# Altium schematic sheet High Voltage Section.SchDoc: Title
size B; Organization: Midnight Sun Solar Rayce Car Team; Address1: University of Waterloo; Address2: 200 University Ave W; Address3: Waterloo, ON, Canada; Address4: N2L 3E9; Website: www.uwmidsun.com; ProjectName: ProjectName
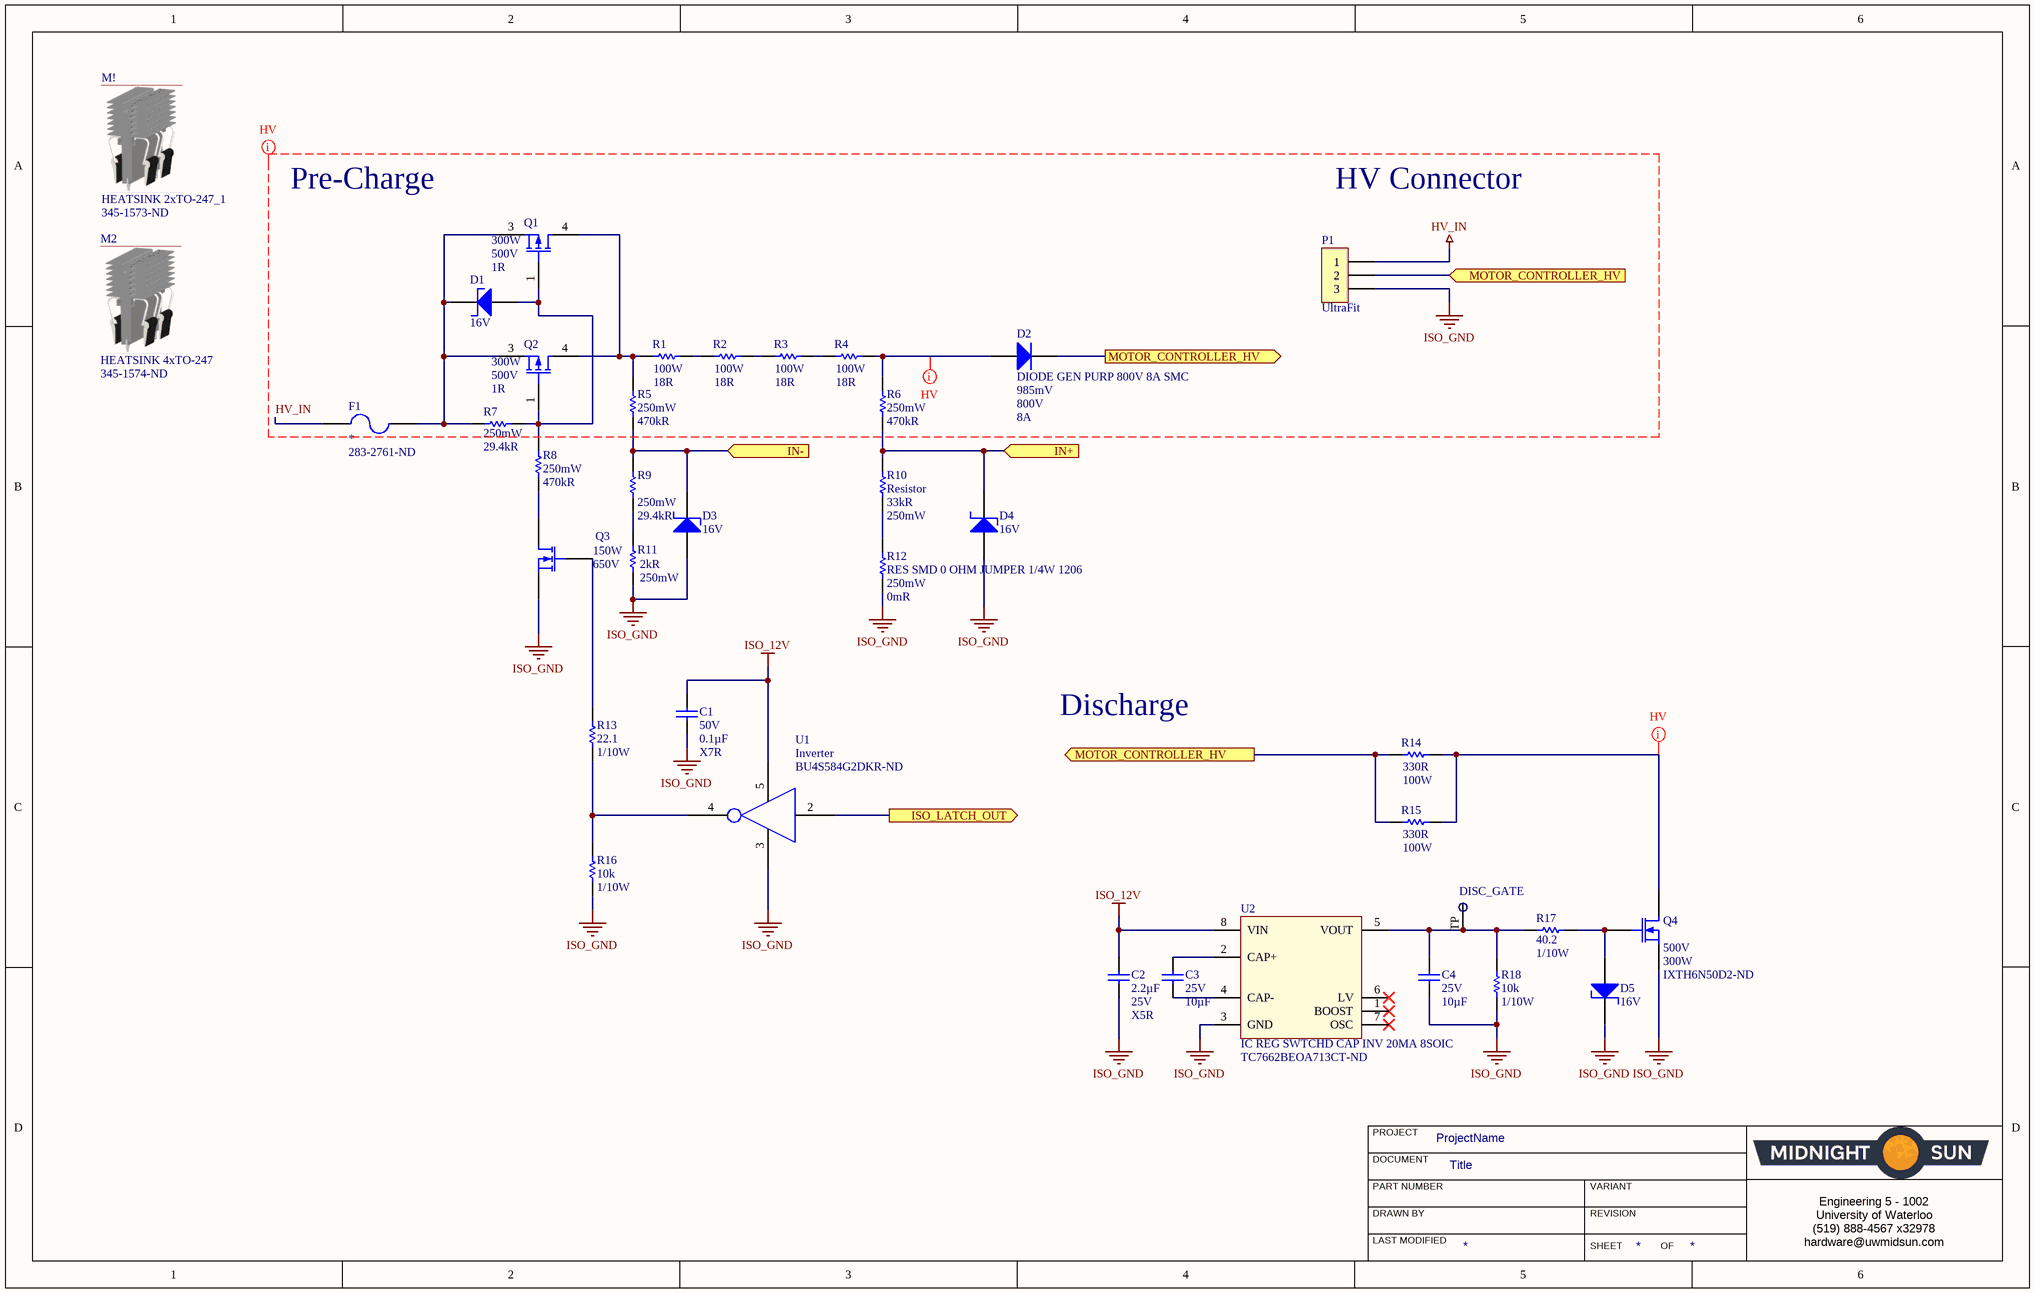
[diagram p0: High Voltage Section.SchDoc]

## Parts
C1  Voltage: 50V  Capacitance: 0.1µF  Temperature Coefficient: X7R  [CAP, 0603]  (hidden comment: CAP CER 0.1UF 50V 10% X7R 0603)
C2  Capacitance: 2.2µF  Voltage: 25V  Temperature Coefficient: X5R  [CAP, 0603]  (hidden comment: CAP CER 2.2UF 25V 10% X5R 0603)
C3  Voltage - Rated: 25V  Capacitance: 10µF  [CAP, 0805]  (hidden comment: CAP CER 10uF 25V 10% X5R 0805)
C4  Voltage - Rated: 25V  Capacitance: 10µF  [CAP, 0805]  (hidden comment: CAP CER 10uF 25V 10% X5R 0805)
D1  Voltage - Zener (Nom): 16V  [DO-214AA Diode]  (hidden comment: DIODE ZENER 16V 5W DO-214AA (SMB))
D2  DIODE GEN PURP 800V 8A SMC  Forward Voltage: 985mV  Max Reverse Voltage (DC): 800V  Forward Current: 8A  [DIODE, SMC]
D3  Voltage - Zener (Nom): 16V  [DO-214AA Diode]  (hidden comment: DIODE ZENER 16V 5W DO-214AA (SMB))
D4  Voltage - Zener (Nom): 16V  [DO-214AA Diode]  (hidden comment: DIODE ZENER 16V 5W DO-214AA (SMB))
D5  Voltage - Zener (Nom): 16V  [DO-214AA Diode]  (hidden comment: DIODE ZENER 16V 5W DO-214AA (SMB))
DISC_GATE  Test Point  [Test Point]  (value not drawn)  (no BOM)
F1  *  [FUSE 5A 400VDC RADIAL]
M2  HEATSINK 4xTO-247  Supplier Part Number 1: 345-1574-ND  [HEATSINK 4x TO-247]
M!  HEATSINK 2xTO-247_1  Supplier Part Number 1: 345-1573-ND  [HEATSINK 2x TO-247]
P1  Series: UltraFit  (hidden comment: CONN 3POS ULTRA-FIT 0.138")
Q1  Max Power Dissipation: 300W  Rds On Max: 1R  Drain to Source Voltage (Vdss): 500V  [P-CH MOSFET 500V 10A 300W TO-263]  (hidden comment: IXTA10P50P)
Q2  Max Power Dissipation: 300W  Rds On Max: 1R  Drain to Source Voltage (Vdss): 500V  [P-CH MOSFET 500V 10A 300W TO-263]  (hidden comment: IXTA10P50P)
Q3  Max Power Dissipation: 150W  Drain to Source Voltage (Vdss): 650V  [P-CH MOSFET 500V 10A 300W TO-263]  (hidden comment: MOSFET N-CH 650V 8A X2 TO-263)
Q4  Drain to Source Voltage (Vdss): 500V  Max Power Dissipation: 300W  Supplier Part Number 1: IXTH6N50D2-ND  [N-CH Depletion Mode TO-247-3]  (hidden comment: MOSFET DEPLETION N-CH 500V 6A TO247)
R1  Power Rating: 100W  Resistance: 18R  [RES TO-247-2]  (hidden comment: RES 18 OHM 100W 5% TO-247)
R2  Power Rating: 100W  Resistance: 18R  [RES TO-247-2]  (hidden comment: RES 18 OHM 100W 5% TO-247)
R3  Power Rating: 100W  Resistance: 18R  [RES TO-247-2]  (hidden comment: RES 18 OHM 100W 5% TO-247)
R4  Power Rating: 100W  Resistance: 18R  [RES TO-247-2]  (hidden comment: RES 18 OHM 100W 5% TO-247)
R5  Max Power Dissipation: 250mW  Resistance: 470kR  [RES 1206]  (hidden comment: RESISTOR)
R6  Max Power Dissipation: 250mW  Resistance: 470kR  [RES 1206]  (hidden comment: RESISTOR)
R7  Max Power Dissipation: 250mW  Resistance: 29.4kR  [RES 1206]  (hidden comment: Resistor)
R8  Max Power Dissipation: 250mW  Resistance: 470kR  [RES 1206]  (hidden comment: RESISTOR)
R9  Max Power Dissipation: 250mW  Resistance: 29.4kR  [RES 1206]  (hidden comment: Resistor)
R10  Resistor  Resistance: 33kR  Max Power Dissipation: 250mW  [RES 1206]
R11  Max Power Dissipation: 250mW  Resistance: 2kR  [RES 1206]  (hidden comment: RES SMD 2K OHM 0.1% 1/4W 1206)
R12  RES SMD 0 OHM JUMPER 1/4W 1206  Power Rating: 250mW  Resistance: 0mR  [RES 1206]
R13  Resistance: 22.1  Power: 1/10W  [RES, 0603]  (hidden comment: RES 22.1 OHM 1% 1/10W 0603)
R14  Max Power Dissipation: 100W  Resistance: 330R  [RES TO-247-2]  (hidden comment: RES 330 OHM 100W 5% TO-247)
R15  Max Power Dissipation: 100W  Resistance: 330R  [RES TO-247-2]  (hidden comment: RES 330 OHM 100W 5% TO-247)
R16  Resistance: 10k  Power: 1/10W  [RES, 0603]  (hidden comment: RES 10K OHM 1% 1/10W 0603)
R17  Resistance: 40.2  Power: 1/10W  [RES, 0603]  (hidden comment: RES 40.2 OHM 0.5% 1/10W 0603)
R18  Resistance: 10k  Power: 1/10W  [RES, 0603]  (hidden comment: RES 10K OHM 1% 1/10W 0603)
U1  Inverter  Supplier Part Number 1: BU4S584G2DKR-ND  [SSOP5 - Inverter]
U2  IC REG SWTCHD CAP INV 20MA 8SOIC  Supplier Part Number 1: TC7662BEOA713CT-ND  [SOIC8]

## Ports
IN+ (in), IN- (in), ISO_LATCH_OUT (out), MOTOR_CONTROLLER_HV (in), MOTOR_CONTROLLER_HV (out)

## Nets
HV_IN: F1.1 P1.1
ISO_12V: C1.1 C2.2 U1.5(IN+) U2.8(VIN)
ISO_GND: C1.2 C2.1 C4.2 D3.1(A) D4.1(A) D5.2(K) P1.3 Q3.3(S) Q4.3(S) R11.2 R12.2 R16.2 R18.2 U1.3(IN-) U2.3(GND)
IN+: D4.2(K) R6.2 R10.1 ; port IN+
IN-: D3.2(K) R5.2 R9.1 ; port IN-
ISO_LATCH_OUT: U1.2(INPUT) ; port ISO_LATCH_OUT
MOTOR_CONTROLLER_HV: D2.1(K) P1.2 R14.1 R15.1 ; port MOTOR_CONTROLLER_HV
NetC3_1: C3.1 U2.2(CAP+)
NetC3_2: C3.2 U2.4(CAP-)
NetC4_1: C4.1 DISC_GATE.TP R17.1 R18.1 U2.5(VOUT)
NetD1_1: D1.1(A) Q1.1(G) Q2.1(G) R7.2 R8.1
NetD1_2: D1.2(K) F1.2 Q1.3(S) Q2.3(S) R7.1
NetD2_2: D2.2(A) R4.2 R6.1
NetD5_1: D5.1(A) Q4.1(G) R17.2
NetQ1_4: Q1.4(D) Q2.4(D) R1.1 R5.1
NetQ3_1: Q3.1(G) R13.1
NetQ3_4: Q3.4(D) R8.2
NetQ4_2: Q4.2(D) R14.2 R15.2
NetR1_2: R1.2 R2.1
NetR2_2: R2.2 R3.1
NetR3_2: R3.2 R4.1
NetR9_2: R9.2 R11.1
NetR10_2: R10.2 R12.1
NetR13_2: R13.2 R16.1 U1.4(OUTPUT)

Not connected (* = marked no-connect by the designer): U2 1(BOOST)* 6(LV)* 7(OSC)*

## Layout directives
rule Clearance Constraint [Clearance = 1.25mm]; net class HV: HV_IN, ISO_GND, NetD2_2
rule Clearance Constraint [Generic clearance = 0.254mm, and 9 value(s) for objects]; net class HV: NetQ4_2

## Notes on the sheet
- Pre-Charge
- HV Connector
- Discharge
- PROJECT
- DOCUMENT
- DRAWN BY
- LAST MODIFIED
- PART NUMBER
- REVISION
- SHEET
- VARIANT
- OF
- Engineering 5 - 1002
  University of Waterloo
  (519) 888-4567 x32978
  hardware@uwmidsun.com

## Library data of the parts
C1 = CAP CER 0.1UF 50V 10% X7R 0603: 0.10µF ±10% 50V Ceramic Capacitor X7R 0603 (1608 Metric); Manufacturer 1: AVX Corporation; Manufacturer Part Number 1: 06035C104KAT2A; Supplier 1: Digi-Key; Supplier Part Number 1: 478-5052-1-ND; Packaging: Cut Tape (CT); Part Status: Active; Operating Temperature: -55°C ~ 125°C; Ratings: -; Mounting Type: Surface Mount, MLCC; Package / Case: 0603 (1608 Metric); Size / Dimension: 0.063" L x 0.032" W (1.60mm x 0.81mm); Height - Seated (Max): -; Thickness (Max): 0.035" (0.90mm); Lead Spacing: -; Lead Style: -; ComponentLink1URL: http://datasheets.avx.com/X7RDielectric.pdf; ComponentLink1Description: http://datasheets.avx.com/X7RDielectric.pdf; Tolerance: ±10%
C2 = CAP CER 2.2UF 25V 10% X5R 0603: 2.2µF ±10% 25V Ceramic Capacitor X5R 0603 (1608 Metric); Manufacturer 1: Murata Electronics North America; Manufacturer Part Number 1: GRM188R61E225KA12D; Supplier 1: Digi-Key; Supplier Part Number 1: 490-10731-1-ND; Packaging: Cut Tape (CT); Part Status: Active; Operating Temperature: -55°C ~ 85°C; Ratings: -; Mounting Type: Surface Mount, MLCC; Package / Case: 0603 (1608 Metric); Size / Dimension: 0.063" L x 0.031" W (1.60mm x 0.80mm); Height - Seated (Max): -; Thickness (Max): 0.035" (0.90mm); Lead Spacing: -; Lead Style: -; ComponentLink1URL: http://www.murata.com/~/media/webrenewal/support/library/catalog/products/capacitor/mlcc/c02e.ashx; ComponentLink1Description: http://www.murata.com/~/media/webrenewal/support/library/catalog/products/capacitor/mlcc/c02e.ashx; Tolerance: ±10%
C3 C4 = CAP CER 10uF 25V 10% X5R 0805: 10µF ±10% 25V Ceramic Capacitor X5R 0805 (2012 Metric); Manufacturer: Murata Electronics North America; Manufacturer Part Number: GRM21BR61E106KA73L; Supplier 1: Digi-Key; RoHS: RoHS Compliant; Category: Capacitors; Stock 1: 1695157; Packaging: Cut Tape (CT); Part Status: Active; Tolerance: ±10%; Temperature Coefficient: X5R; Operating Temperature: -55°C ~ 85°C; Features: -; Ratings: -; Applications: General Purpose; Mounting Type: Surface Mount, MLCC; Package / Case: 0805 (2012 Metric); Size / Dimension: 0.079" L x 0.049" W (2.00mm x 1.25mm); Height - Seated (Max): -; Thickness (Max): 0.053" (1.35mm); Lead Spacing: -; Lead Style: -; ComponentLink1URL: http://search.murata.co.jp/Ceramy/image/img/A01X/G101/ENG/GRM21BR61E106KA73-01.pdf; ComponentLink1Description: http://search.murata.co.jp/Ceramy/image/img/A01X/G101/ENG/GRM21BR61E106KA73-01.pdf; Supplier Part Number 1: 490-5523-1-ND; Pricing 1: 1=0.3, 10=0.214, 100=0.1008, 500=0.07068, 1000=0.05851 (CAD)
D1 D3-D5 = DIODE ZENER 16V 5W DO-214AA (SMB): Zener Diode 16V 5W ±5% Surface Mount DO-214AA (SMB); Manufacture: Micro Commercial Co; Manufacture Part Number: SMBJ5353B-TP; Impedence (Max): 2.5 Ohm; Voltage - Forward: 1.2V @ 1A; Power (Max): 5W; Supplier 1: Digi-Key; Supplier Part Number 1: SMBJ5353B-TPMSCT-ND
D2 = DIODE GEN PURP 800V 8A SMC: Manufacturer: Diodes; Manufacturer Part Number: S8KC-13; Peak Reverse Current: 10uA; Max Surge Current: 200A; Element Configuration: Single; Supplier 1: Digi-Key; Stock 1: 38298; Pricing 1: 1=0.68, 10=0.598, 100=0.4586, 500=0.36256, 1000=0.29005 (USD); Mount: Surface Mount; Case/Package: SMC; Number of Pins: 2; Weight: 0.007408oz; Contact Plating: Tin,Matte; Min Operating Temperature: -65°C; Max Operating Temperature: 150°C; Packaging: Tape and Reel; Package Quantity: 3000; Reverse Voltage (DC): 800V; Average Rectified Current: 8A; Max Repetitive Reverse Voltage (Vrrm): 800V; Peak Non-Repetitive Surge Current: 200A; Max Forward Surge Current (Ifsm): 200A; Length: 7.11mm; Height: 2.42mm; Width: 6.22mm; Radiation Hardening: No; Lead Free: Lead Free; ComponentLink1URL: https://datasheet.ciiva.com/15144/getdatasheetpartid-61102-15144323.pdf; ComponentLink1Description: https://datasheet.ciiva.com/15144/getdatasheetpartid-61102-15144323.pdf; ComponentLink2URL: https://datasheet.ciiva.com/16388/ds31117-16388346.pdf; ComponentLink2Description: https://datasheet.ciiva.com/16388/ds31117-16388346.pdf; ComponentLink3URL: https://datasheet.ciiva.com/914/ds31117-914779.pdf; ComponentLink3Description: https://datasheet.ciiva.com/914/ds31117-914779.pdf; ComponentLink4URL: https://datasheet.ciiva.com/4453/ds31117-63855-4453947.pdf; ComponentLink4Description: https://datasheet.ciiva.com/4453/ds31117-63855-4453947.pdf; Supplier Part Number 1: S8KCDICT-ND
F1 = FUSE BOARD MNT 3A 250VAC/450VDC: 283-2761-ND; Supplier 1: Digi-Key; ComponentLink1Description: https://www.digikey.ca/products/en?keywords=283-2761-ND; ComponentLink1URL: https://www.digikey.ca/products/en?keywords=283-2761-ND; Supplier Part Number 1: 283-2761-ND
M2 = HEATSINK 4xTO-247: n Heat Sink TO-220, TO-247, TO-264 Aluminum Board Level, Vertical; Manufacturer: Wakefield; Manufacturer Part Number: OMNI-UNI-30-50-D; Supplier 1: Digi-Key; Stock 1: 465; Pricing 1: 1=4.09, 10=3.98, 25=3.8724, 50=3.6572, 100=3.4421, 250=3.22696, 500=3.11938, 1000=2.79669 (USD)
M! = HEATSINK 2xTO-247_1: Heat Sink TO-220, TO-247, TO-264 Aluminum Board Level, Vertical; Manufacturer: Wakefield; Manufacturer Part Number: OMNI-UNI-30-50-D; Supplier 1: Digi-Key; Stock 1: 499; Pricing 1: 1=2.8, 10=2.728, 25=2.6544, 50=2.5068, 100=2.3594, 250=2.21192, 500=2.13818, 1000=1.91698, 5000=1.88012 (USD)
P1 = CONN 3POS ULTRA-FIT 0.138": 3 Positions Header Connector 0.138" (3.50mm) Through Hole Tin; Manufacturer 1: Molex, LLC; Manufacturer Part Number 1: 1722871103; Style: Board to Cable/Wire; Shrouding: Shrouded - 4 Wall; Number of Positions: 3; Number of Positions Loaded: All; Contact Length - Post: 0.126" (3.20mm); Material Flammability Rating: UL94 V-0; Mated Stacking Heights: 26.99mm; Voltage: 400V; Supplier 1: Digi-Key; Supplier Part Number 1: WM11702-ND; Packaging: Tray; Part Status: Active; Connector Type: Header; Contact Type: Male Pin; Pitch - Mating: 0.138" (3.50mm); Number of Rows: 1; Row Spacing - Mating: -; Mounting Type: Through Hole; Termination: Solder; Fastening Type: Latch Holder; Contact Length - Mating: -; Overall Contact Length: -; Insulation Height: 0.465" (11.80mm); Contact Shape: Square; Contact Finish - Mating: Tin; Contact Finish Thickness - Mating: 60µin (1.52µm); Contact Finish - Post: Tin; Contact Material: Copper Alloy; Insulation Material: Liquid Crystal Polymer (LCP); Operating Temperature: -40°C ~ 105°C; Ingress Protection: -; Insulation Color: Black; Current Rating: -; Contact Finish Thickness - Post: 60µin (1.52µm); ComponentLink1URL: http://www.molex.com/pdm_docs/sd/1722871103_sd.pdf; ComponentLink1Description: http://www.molex.com/pdm_docs/sd/1722871103_sd.pdf
Q1 Q2 = MOSFET P-CH 500V 10A 300W TO-263: P-Channel 500V 10A (Tc) 300W (Tc) Surface Mount TO-263 (IXTA); Manufacturer: IXYS; Input Capacitance: 2.84nF; Rise Time: 28ns; Fall Time: 44ns; Turn-Off Delay Time: 52ns; Number of Elements: 1; Element Configuration: Single; Drain to Source Breakdown Voltage: -500V; Gate to Source Voltage (Vgs): 20V; Supplier 1: Digi-Key; Manufacturer Part Number: IXTA10P50P; Stock 1: 2142; Pricing 1: 1=5.96, 10=5.319, 100=4.3614, 500=3.53166, 1000=2.9785 (USD); Mount: Surface Mount; Case/Package: TO-263; Min Operating Temperature: -55°C; Max Operating Temperature: 150°C; Package Quantity: 50; Packaging: Rail/Tube; Continuous Drain Current (ID): 10A; Drain to Source Resistance: 1R; Power Dissipation: 300W; On-State Resistance: 1R; Radiation Hardening: No; Lead Free: Lead Free; ComponentLink1URL: https://datasheet.ciiva.com/15203/getdatasheetpartid-371166-15203275.pdf; ComponentLink1Description: https://datasheet.ciiva.com/15203/getdatasheetpartid-371166-15203275.pdf; Supplier Part Number 1: IXTA10P50P-ND
Q3 = MOSFET N-CH 650V 8A X2 TO-263: N-Channel 650V 8A (Tc) 150W (Tc) Surface Mount TO-263; Manufacturer: IXYS; Manufacturer Part Number: IXTA8N65X2; Rds On Max: 500mR; Input Capacitance: 800pF; Supplier 1: Digi-Key; Stock 1: 69; Pricing 1: 1=2.85, 10=2.576, 100=2.07, 500=1.61, 1000=1.334 (USD); Mount: Surface Mount; Case/Package: TO-263-3; Min Operating Temperature: -55°C; Max Operating Temperature: 150°C; Packaging: Rail/Tube; Continuous Drain Current (ID): 8A; ComponentLink1URL: http://www.mouser.com/ds/2/205/DS100649B(IXTY-TA-TP8N65X2)-1132259.pdf; ComponentLink1Description: http://www.mouser.com/ds/2/205/DS100649B(IXTY-TA-TP8N65X2)-1132259.pdf; ComponentLink2URL: http://ixapps.ixys.com/DataSheet/DS100649B(IXTY-TA-TP8N65X2).pdf; ComponentLink2Description: http://ixapps.ixys.com/DataSheet/DS100649B(IXTY-TA-TP8N65X2).pdf; Supplier Part Number 1: IXTA8N65X2-ND
Q4 = MOSFET DEPLETION N-CH 500V 6A TO247: N-Channel 500V 6A (Tc) 300W (Tc) Through Hole TO-247 (IXTH); Manufacturer: IXYS; Manufacturer Part Number: IXTH6N50D2; Rds On Max: 500mR; Input Capacitance: 2.8nF; Stock 1: 79; Pricing 1: 1=7.25, 10=6.521, 100=5.3613, 500=4.4919, 1000=3.9123 (USD); Mount: Through Hole; Case/Package: TO-247-3; Packaging: Rail/Tube; Package Quantity: 30; Continuous Drain Current (ID): 6A; ComponentLink1URL: https://datasheet.ciiva.com/949/ds100177bixta-tp-th6n50d2-949628.pdf; ComponentLink1Description: https://datasheet.ciiva.com/949/ds100177bixta-tp-th6n50d2-949628.pdf; ComponentLink2URL: https://datasheet.ciiva.com/26790/ixth6n50d2-26790808.pdf; ComponentLink2Description: https://datasheet.ciiva.com/26790/ixth6n50d2-26790808.pdf; Supplier 1: Digi-Key
R1-R4 = RES 18 OHM 100W 5% TO-247: 18 Ohms ±5% 100W Through Hole Resistor TO-247-2 Moisture Resistant, Non-Inductive Thick Film; Manufacturer: Ohmite; Manufacturer Part Number: AP10118RJ; Voltage Rating: 700V; Temperature Coefficient: 100ppm/°C; Supplier 1: Digi-Key; Stock 1: 0; Case/Package: TO-247-2; Min Operating Temperature: -65°C; Max Operating Temperature: 175°C; Packaging: Tray; Composition: Thick Film; Number of Terminations: 2; Tolerance: 5%; Max Power Dissipation: 100W; Voltage Rating (DC): 700V; Length: 0.62inch; Height: 0.825inch; Width: 0.195inch; REACH SVHC: Unknown; ComponentLink1URL: http://www.farnell.com/datasheets/2015590.pdf; ComponentLink1Description: http://www.farnell.com/datasheets/2015590.pdf; ComponentLink2URL: http://www.mouser.com/ds/2/303/acl_ap101-773331.pdf; ComponentLink2Description: http://www.mouser.com/ds/2/303/acl_ap101-773331.pdf; ComponentLink3URL: http://www.ohmite.com/cat/acl_ap101.pdf; ComponentLink3Description: http://www.ohmite.com/cat/acl_ap101.pdf; Supplier Part Number 1: AP101 18R J-ND
R5 R6 R8 = RES SMD 470K OHM 0.1% 1/4W 1206: 470 kOhms ±0.1% 0.25W, 1/4W Chip Resistor 1206 (3216 Metric) Anti-Sulfur, Automotive AEC-Q200 Thin Film; Manufacturer: Susumu; Manufacturer Part Number: RG3216P-4703-B-T1; Power Rating: 125mW; Voltage Rating: 150V; Temperature Coefficient: 25ppm/°C; Voltage Rating (DC): 200V; Supplier 1: Digi-Key; Stock 1: 2986; Pricing 1: 1=0.66, 10=0.474, 100=0.2462 (USD); Case/Package: 1206; Number of Pins: 2; Case Code (Metric): 3216; Case Code (Imperial): 1206; Min Operating Temperature: -55°C; Max Operating Temperature: 155°C; Tolerance: 0.1%; Packaging: Tape and Reel; Package Quantity: 1; Composition: Thin Film; Number of Terminations: 2; Termination: SMD/SMT; Length: 0.126inch; Height: 0.02inch; Width: 0.063inch; Lead Free: Lead Free; ComponentLink1URL: https://datasheet.ciiva.com/2490/rg-rm-rgh-datasheet-2490488.pdf; ComponentLink1Description: https://datasheet.ciiva.com/2490/rg-rm-rgh-datasheet-2490488.pdf; ComponentLink2URL: https://datasheet.ciiva.com/2490/rg-rm-rgh-datasheet-2490489.pdf; ComponentLink2Description: https://datasheet.ciiva.com/2490/rg-rm-rgh-datasheet-2490489.pdf; ComponentLink3URL: https://datasheet.ciiva.com/2490/rg-rm-rgh-datasheet-2490490.pdf; ComponentLink3Description: https://datasheet.ciiva.com/2490/rg-rm-rgh-datasheet-2490490.pdf; ComponentLink4URL: https://datasheet.ciiva.com/12760/rg-rm-rgh-datasheet-12760397.pdf; ComponentLink4Description: https://datasheet.ciiva.com/12760/rg-rm-rgh-datasheet-12760397.pdf; Supplier Part Number 1: RG32P470KBDKR-ND
R7 R9 = RES SMD 29.4K OHM 1% 1/4W 1206: 29.4 kOhms ±1% 0.25W, 1/4W Chip Resistor 1206 (3216 Metric) Automotive AEC-Q200 Thick Film; Manufacturer: Panasonic; Manufacturer Part Number: ERJ-8ENF2942V; Voltage Rating: 200V; Temperature Coefficient: 100ppm/°C; Supplier 1: Digi-Key; Stock 1: 24502; Pricing 1: 1=0.11, 10=0.097, 100=0.0373, 1000=0.01641, 2500=0.01417 (USD); Mount: Surface Mount; Case/Package: 1206; Weight: 0.000571oz; Case Code (Metric): 3216; Case Code (Imperial): 1206; Contact Plating: Tin; Min Operating Temperature: -55°C; Max Operating Temperature: 155°C; Packaging: Tape and Reel; Power Rating: 250mW; Tolerance: 1%; Package Quantity: 1; Composition: Thick Film; Number of Terminations: 2; Voltage Rating (DC): 200V; Termination: SMD/SMT; Military Standard: Not; Length: 3.2mm; Height: 0.028inch; Width: 0.063inch; Depth: 1.6mm; REACH SVHC: No SVHC; ComponentLink1URL: https://datasheet.ciiva.com/7861/426256-7861912.pdf; ComponentLink1Description: https://datasheet.ciiva.com/7861/426256-7861912.pdf; ComponentLink2URL: https://datasheet.ciiva.com/24126/aoa0000ce2-24126731.pdf; ComponentLink2Description: https://datasheet.ciiva.com/24126/aoa0000ce2-24126731.pdf; ComponentLink3URL: https://datasheet.ciiva.com/6159/426256-6159628.pdf; ComponentLink3Description: https://datasheet.ciiva.com/6159/426256-6159628.pdf; ComponentLink4URL: https://datasheet.ciiva.com/9191/aoa0000ce2-9191007.pdf; ComponentLink4Description: https://datasheet.ciiva.com/9191/aoa0000ce2-9191007.pdf; Supplier Part Number 1: P29.4KFCT-ND
R10 = RES SMD 33K OHM 0.1% 1/4W 1206: 33 kOhms ±0.1% 0.25W, 1/4W Chip Resistor 1206 (3216 Metric) Thin Film; Manufacturer: Yageo; Manufacturer Part Number: RT1206BRD0733KL; Voltage Rating: 200V; Temperature Coefficient: 25ppm/°C; Supplier 1: Digi-Key; Stock 1: 13446; Pricing 1: 1=0.68, 10=0.523, 100=0.22, 1000=0.12137, 2500=0.11378 (USD); Case/Package: 1206; Case Code (Metric): 3216; Case Code (Imperial): 1206; Contact Plating: Tin,Matte; Min Operating Temperature: -55°C; Max Operating Temperature: 125°C; Power Rating: 250mW; Tolerance: 0.1%; Packaging: Tape and Reel; Package Quantity: 5000; Termination: SMD/SMT; Composition: Thin Film; Number of Terminations: 2; Military Standard: Not; Voltage Rating (DC): 200V; Length: 0.122inch; Height: 0.026inch; Width: 0.063inch; Depth: 1.6mm; Radiation Hardening: No; Lead Free: Lead Free; ComponentLink1URL: https://datasheet.ciiva.com/2587/pyu-rt-1-to-0-05-rohs-l-4-2587636.pdf; ComponentLink1Description: https://datasheet.ciiva.com/2587/pyu-rt-1-to-0-05-rohs-l-4-2587636.pdf; ComponentLink2URL: https://datasheet.ciiva.com/46634/pyu-rt-1-to-0-05-rohs-l-5-46634965.pdf; ComponentLink2Description: https://datasheet.ciiva.com/46634/pyu-rt-1-to-0-05-rohs-l-5-46634965.pdf; Supplier Part Number 1: YAG2038CT-ND
R11 = RES SMD 2K OHM 0.1% 1/4W 1206: 2 kOhms ±0.1% 0.25W, 1/4W Chip Resistor 1206 (3216 Metric) Automotive AEC-Q200 Thin Film; Manufacturer: Panasonic; Manufacturer Part Number: ERA-8AEB202V; Voltage Rating: 150V; Temperature Coefficient: 25ppm/°C; Supplier 1: Digi-Key; Stock 1: 43293; Pricing 1: 1=0.66, 10=0.474, 100=0.2465, 1000=0.13276, 2500=0.13095 (USD); Mount: Surface Mount; Case/Package: 1206; Number of Pins: 2; Weight: 0.000571oz; Case Code (Metric): 3216; Case Code (Imperial): 1206; Contact Plating: Tin; Min Operating Temperature: -55°C; Max Operating Temperature: 155°C; Power Rating: 250mW; Tolerance: 0.1%; Packaging: Tape and Reel; Package Quantity: 5000; Composition: Metal Film,Thin Film; Number of Terminations: 2; Termination: SMD/SMT; Military Standard: Not; Voltage Rating (DC): 150V; Length: 3.2mm; Height: 0.6mm; Width: 0.063inch; Depth: 1.6mm; Radiation Hardening: No; REACH SVHC: No SVHC; Lead Free: Lead Free; ComponentLink1URL: https://datasheet.ciiva.com/43458/391390-43458070.pdf; ComponentLink1Description: https://datasheet.ciiva.com/43458/391390-43458070.pdf; ComponentLink2URL: https://datasheet.ciiva.com/48529/era-eng-tds-48529591.pdf; ComponentLink2Description: https://datasheet.ciiva.com/48529/era-eng-tds-48529591.pdf; ComponentLink3URL: https://datasheet.ciiva.com/6082/391390-6082060.pdf; ComponentLink3Description: https://datasheet.ciiva.com/6082/391390-6082060.pdf; ComponentLink4URL: https://datasheet.ciiva.com/17214/aoa0000ce26-17214381.pdf; ComponentLink4Description: https://datasheet.ciiva.com/17214/aoa0000ce26-17214381.pdf; ComponentLink5URL: https://datasheet.ciiva.com/9197/aoa0000ce26-9197582.pdf; ComponentLink5Description: https://datasheet.ciiva.com/9197/aoa0000ce26-9197582.pdf; Supplier Part Number 1: P2.0KBCCT-ND
R12 = RES SMD 0 OHM JUMPER 1/4W 1206: 0 Ohms Jumper 0.25W, 1/4W Chip Resistor 1206 (3216 Metric) Automotive AEC-Q200 Thick Film; Manufacturer: Vishay; Manufacturer Part Number: CRCW12060000Z0EA; Tolerance: 1%; Voltage Rating: 200V; Temperature Coefficient: 100ppm/°C; Supplier 1: Digi-Key; Stock 1: 0; Pricing 1: 1=0.1, 10=0.064, 25=0.046, 50=0.0352, 100=0.0259, 250=0.01976, 500=0.0158, 1000=0.01163 (USD); Mount: Surface Mount; Case/Package: 1206; Weight: 0.000353oz; Case Code (Imperial): 1206; Case Code (Metric): 3216; Contact Plating: Tin; Min Operating Temperature: -55°C; Max Operating Temperature: 155°C; Composition: Thick Film; Packaging: Tape and Reel; Package Quantity: 5000; Military Standard: Not; Termination: SMD/SMT; Voltage Rating (DC): 200V; Length: 3.2mm; Height: 0.55mm; Width: 1.6mm; Depth: 1.6mm; Radiation Hardening: No; REACH SVHC: Unknown; Lead Free: Lead Free; ComponentLink1URL: https://datasheet.ciiva.com/16720/70201119-16720117.pdf; ComponentLink1Description: https://datasheet.ciiva.com/16720/70201119-16720117.pdf; ComponentLink2URL: https://datasheet.ciiva.com/7841/1720486-7841862.pdf; ComponentLink2Description: https://datasheet.ciiva.com/7841/1720486-7841862.pdf; ComponentLink3URL: https://datasheet.ciiva.com/16364/dcrcwe3-16364998.pdf; ComponentLink3Description: https://datasheet.ciiva.com/16364/dcrcwe3-16364998.pdf; ComponentLink4URL: https://datasheet.ciiva.com/5549/dcrcwe3-109170-5549528.pdf; ComponentLink4Description: https://datasheet.ciiva.com/5549/dcrcwe3-109170-5549528.pdf; ComponentLink5URL: https://datasheet.ciiva.com/7841/1697337-7841706.pdf; ComponentLink5Description: https://datasheet.ciiva.com/7841/1697337-7841706.pdf; ComponentLink6URL: https://datasheet.ciiva.com/11809/0900766b80d98b5e-11809211.pdf; ComponentLink6Description: https://datasheet.ciiva.com/11809/0900766b80d98b5e-11809211.pdf; ComponentLink7URL: https://datasheet.ciiva.com/16782/70201119-16782555.pdf; ComponentLink7Description: https://datasheet.ciiva.com/16782/70201119-16782555.pdf; Supplier Part Number 1: 541-0.0ECT-ND
R13 = RES 22.1 OHM 1% 1/10W 0603: 22.1 Ohm ±1% 0.1W, 1/10W Chip Resistor 0603 (1608 Metric) Moisture Resistant Thick Film; Manufacturer 1: Yageo; Manufacturer Part Number 1: RC0603FR-0722R1L; Temperature Coefficient: ±100ppm/°C; Supplier 1: Digi-Key; Supplier Part Number 1: 311-22.1HRCT-ND; Packaging: Cut Tape (CT); Part Status: Active; Composition: Thick Film; Operating Temperature: -55°C ~ 155°C; Package / Case: 0603 (1608 Metric); Supplier Device Package: 0603; Size / Dimension: 0.063" L x 0.031" W (1.60mm x 0.80mm); Height - Seated (Max): 0.022" (0.55mm); Failure Rate: -; ComponentLink1URL: http://www.yageo.com/documents/recent/PYu-RC_Group_51_RoHS_L_7.pdf; ComponentLink1Description: http://www.yageo.com/documents/recent/PYu-RC_Group_51_RoHS_L_7.pdf; Tolerance: ±1%
R14 R15 = RES 330 OHM 100W 5% TO-247: Manufacturer: Ohmite; Manufacturer Part Number: AP101330RJ; Voltage Rating: 700V; Temperature Coefficient: 100ppm/°C; Supplier 1: Digi-Key; Stock 1: 0; Case/Package: TO-247-2; Min Operating Temperature: -65°C; Max Operating Temperature: 175°C; Packaging: Tray; Power Rating: 100W; Composition: Thick Film; Number of Terminations: 2; Tolerance: 5%; Voltage Rating (DC): 700V; Length: 0.62inch; Height: 0.825inch; Width: 0.195inch; ComponentLink1URL: http://www.mouser.com/ds/2/303/acl_ap101-773331.pdf; ComponentLink1Description: http://www.mouser.com/ds/2/303/acl_ap101-773331.pdf; ComponentLink2URL: http://www.farnell.com/datasheets/2015590.pdf; ComponentLink2Description: http://www.farnell.com/datasheets/2015590.pdf; ComponentLink3URL: http://www.ohmite.com/cat/acl_ap101.pdf; ComponentLink3Description: http://www.ohmite.com/cat/acl_ap101.pdf; Supplier Part Number 1: AP101 330R J-ND
R16 R18 = RES 10K OHM 1% 1/10W 0603: RES SMD 10K OHM 1% 1/10W 0603; Manufacturer 1: Yageo; Manufacturer Part Number 1: RC0603FR-0710KL; Temperature Coefficient: ±100ppm/°C; Supplier 1: Digi-Key; Supplier Part Number 1: 311-10.0KHRCT-ND; Packaging: Cut Tape (CT); Part Status: Active; Composition: Thick Film; Operating Temperature: -55°C ~ 155°C; Package / Case: 0603 (1608 Metric); Supplier Device Package: 0603; Size / Dimension: 0.063" L x 0.031" W (1.60mm x 0.80mm); Height - Seated (Max): 0.022" (0.55mm); Failure Rate: -; ComponentLink1URL: http://www.yageo.com/documents/recent/PYu-RC_Group_51_RoHS_L_7.pdf; ComponentLink1Description: http://www.yageo.com/documents/recent/PYu-RC_Group_51_RoHS_L_7.pdf; Tolerance: ±1%
R17 = RES 40.2 OHM 0.5% 1/10W 0603: RES SMD 40.2 OHM 0.5% 1/10W 0603; Manufacturer 1: Yageo; Manufacturer Part Number 1: RT0603DRE0740R2L; Temperature Coefficient: ±50ppm/°C; Supplier 1: Digi-Key; Supplier Part Number 1: 311-2576-1-ND; Packaging: Cut Tape (CT); Part Status: Active; Composition: Thin Film; Operating Temperature: -55°C ~ 155°C; Package / Case: 0603 (1608 Metric); Supplier Device Package: 0603; Size / Dimension: 0.063" L x 0.031" W (1.60mm x 0.80mm); Height - Seated (Max): 0.022" (0.55mm); Failure Rate: -; ComponentLink1URL: http://www.yageo.com/documents/recent/PYu-RT_1-to-0.01_RoHS_L_7.pdf; ComponentLink1Description: http://www.yageo.com/documents/recent/PYu-RT_1-to-0.01_RoHS_L_7.pdf; Tolerance: ±0.5%
U1 = IC INVERTER SCHMITT 1CH 5SSOP: Inverter IC 1 Channel Schmitt Trigger 5-SSOP; Manufacturer: Rohm; Manufacturer Part Number: BU4S584G2-TR; Number of Inputs: 1; Min Supply Voltage: 3V; Max Supply Voltage: 16V; Logic Function: Schmitt Trigger,Buffer,Inverter; Propagation Delay: 50ns; Quiescent Current: 1uA; High Level Output Current: 3.4mA; Supplier 1: Digi-Key; Stock 1: 28906; Pricing 1: 1=0.68, 10=0.571, 25=0.4996, 100=0.4283, 250=0.37116, 500=0.31406, 1000=0.24269 (USD); Mount: Surface Mount; Case/Package: SSOP; Number of Pins: 5; Contact Plating: Copper,Tin; Min Operating Temperature: -40°C; Max Operating Temperature: 85°C; Packaging: Tape and Reel; Number of Elements: 1; Package Quantity: 3000; Number of Circuits: 1; Low Level Output Current: 3.4mA; Turn-On Delay Time: 50ns; Number of Gates: 1; Radiation Hardening: No; REACH SVHC: Unknown; Lead Free: Lead Free; ComponentLink1URL: https://datasheet.ciiva.com/16203/bu4s584g2-e-16203782.pdf; ComponentLink1Description: https://datasheet.ciiva.com/16203/bu4s584g2-e-16203782.pdf; ComponentLink2URL: https://datasheet.ciiva.com/8247/bu4s01g2-e-8247480.pdf; ComponentLink2Description: https://datasheet.ciiva.com/8247/bu4s01g2-e-8247480.pdf; ComponentLink3URL: https://datasheet.ciiva.com/1863/bu4s01g2-e-1863485.pdf; ComponentLink3Description: https://datasheet.ciiva.com/1863/bu4s01g2-e-1863485.pdf; ComponentLink4URL: https://datasheet.ciiva.com/1863/bu4s01g2-e-1863486.pdf; ComponentLink4Description: https://datasheet.ciiva.com/1863/bu4s01g2-e-1863486.pdf; ComponentLink5URL: https://datasheet.ciiva.com/15089/getdatasheetpartid-451247-15089726.pdf; ComponentLink5Description: https://datasheet.ciiva.com/15089/getdatasheetpartid-451247-15089726.pdf; ComponentLink6URL: https://datasheet.ciiva.com/1863/bu4s01g2-e-1863487.pdf; ComponentLink6Description: https://datasheet.ciiva.com/1863/bu4s01g2-e-1863487.pdf; ComponentLink7URL: https://datasheet.ciiva.com/26865/bu4s584g2-tr-26865344.pdf; ComponentLink7Description: https://datasheet.ciiva.com/26865/bu4s584g2-tr-26865344.pdf; ComponentLink8URL: https://datasheet.ciiva.com/26326/140506-da-01-en-ic-bu4s584g2-tr-ssop5-26326013.pdf; ComponentLink8Description: https://datasheet.ciiva.com/26326/140506-da-01-en-ic-bu4s584g2-tr-ssop5-26326013.pdf
U2 = IC REG SWTCHD CAP INV 20MA 8SOIC: Charge Pump Switching Regulator IC Positive or Negative Fixed -Vin, 2Vin 1 Output 20mA 8-SOIC (0.154", 3.90mm Width); Manufacturer: Microchip; Manufacturer Part Number: TC7662BEOA713; Number of Outputs: 1; Output Voltage: -15V; Min Supply Voltage: 1.5V; Max Supply Voltage: 15V; Switching Frequency: 35kHz; Synchronous Rectifier: No; Logic Function: Inverting; Output Power: 470mW; Supplier 1: Digi-Key; Stock 1: 59; Pricing 1: 1=2.29, 25=1.9056, 100=1.7304 (USD); Mount: Surface Mount; Case/Package: SOIC; Number of Pins: 8; Weight: 0.006596oz; Min Operating Temperature: -40°C; Max Operating Temperature: 85°C; Package Quantity: 1; Packaging: Tape and Reel; Output Current: 20mA; Max Output Current: 20mA; Max Input Voltage: 15V; Max Output Voltage: -15V; Topology: Charge Pump; Length: 5mm; Height: 1.5mm; Width: 3.99mm; Radiation Hardening: No; Lead Free: Lead Free; ComponentLink1URL: https://datasheet.ciiva.com/2024/21469a-2024368.pdf; ComponentLink1Description: https://datasheet.ciiva.com/2024/21469a-2024368.pdf; ComponentLink2URL: https://datasheet.ciiva.com/2024/filehandler-aspxddocname-en026002-2024369.pdf; ComponentLink2Description: https://datasheet.ciiva.com/2024/filehandler-aspxddocname-en026002-2024369.pdf; ComponentLink3URL: https://datasheet.ciiva.com/16295/filehandler-aspxddocname-en011347-16295442.pdf; ComponentLink3Description: https://datasheet.ciiva.com/16295/filehandler-aspxddocname-en011347-16295442.pdf; ComponentLink4URL: https://datasheet.ciiva.com/3216/cn-21469a-3216331.pdf; ComponentLink4Description: https://datasheet.ciiva.com/3216/cn-21469a-3216331.pdf; ComponentLink5URL: https://datasheet.ciiva.com/18553/filehandler-aspxddocname-en026002-18553038.pdf; ComponentLink5Description: https://datasheet.ciiva.com/18553/filehandler-aspxddocname-en026002-18553038.pdf; ComponentLink6URL: https://datasheet.ciiva.com/4875/21469a-4875151.pdf; ComponentLink6Description: https://datasheet.ciiva.com/4875/21469a-4875151.pdf